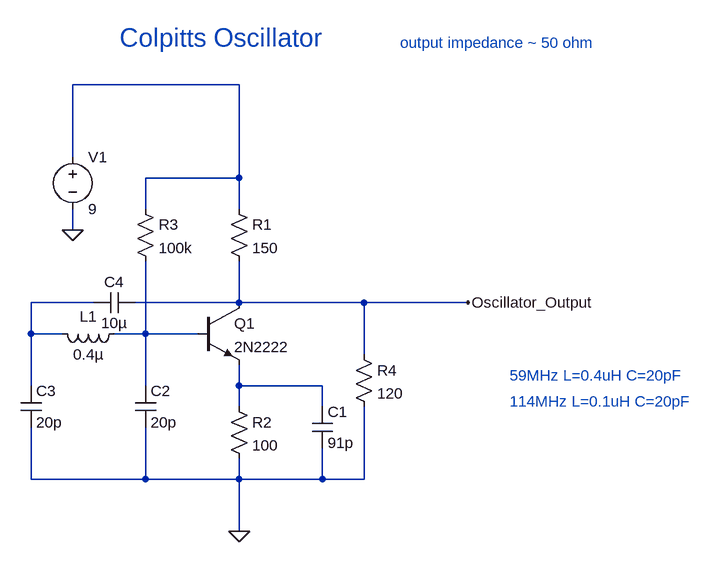
[diagram p0: schematic colpitts_oscillator.asc]
colpitts_oscillator.asc, the LTspice schematic file:
Version 4
SHEET 1 1004 736
WIRE 304 32 48 32
WIRE 48 144 48 32
WIRE 304 176 304 32
WIRE 304 176 160 176
WIRE 160 224 160 176
WIRE 304 224 304 176
WIRE 48 256 48 224
WIRE 80 368 -16 368
WIRE 304 368 304 304
WIRE 304 368 144 368
WIRE 496 368 304 368
WIRE 656 368 496 368
WIRE -16 416 -16 368
WIRE 32 416 -16 416
WIRE 160 416 160 304
WIRE 160 416 112 416
WIRE 240 416 160 416
WIRE 496 448 496 368
WIRE -16 496 -16 416
WIRE 160 496 160 416
WIRE 304 496 304 464
WIRE 432 496 304 496
WIRE 304 528 304 496
WIRE 432 528 432 496
WIRE -16 640 -16 560
WIRE 160 640 160 560
WIRE 160 640 -16 640
WIRE 304 640 304 608
WIRE 304 640 160 640
WIRE 432 640 432 592
WIRE 432 640 304 640
WIRE 496 640 496 528
WIRE 496 640 432 640
WIRE 304 720 304 640
FLAG 304 720 0
FLAG 656 368 Oscillator_Output
FLAG 48 256 0
DATAFLAG 304 352 "$"
DATAFLAG 208 416 "$"
DATAFLAG 304 496 "$"
SYMBOL npn 240 368 R0
SYMATTR InstName Q1
SYMATTR Value 2N2222
SYMBOL res 288 208 R0
SYMATTR InstName R1
SYMATTR Value 150
SYMBOL res 288 512 R0
SYMATTR InstName R2
SYMATTR Value 100
SYMBOL res 144 208 R0
SYMATTR InstName R3
SYMATTR Value 100k
SYMBOL cap 416 528 R0
SYMATTR InstName C1
SYMATTR Value 91p
SYMBOL ind 128 400 R90
WINDOW 0 5 56 VBottom 2
WINDOW 3 32 56 VTop 2
SYMATTR InstName L1
SYMATTR Value 0.4µ
SYMBOL cap 144 496 R0
SYMATTR InstName C2
SYMATTR Value 20p
SYMBOL cap -32 496 R0
SYMATTR InstName C3
SYMATTR Value 20p
SYMBOL cap 144 352 R90
WINDOW 0 0 32 VBottom 2
WINDOW 3 32 32 VTop 2
SYMATTR InstName C4
SYMATTR Value 10µ
SYMBOL voltage 48 128 R0
WINDOW 123 0 0 Left 0
WINDOW 39 0 0 Left 0
SYMATTR InstName V1
SYMATTR Value 9
SYMBOL res 480 432 R0
SYMATTR InstName R4
SYMATTR Value 120
TEXT 720 480 Left 2 ;59MHz L=0.4uH C=20pF
TEXT 720 520 Left 2 ;114MHz L=0.1uH C=20pF
TEXT 120 -40 Left 4 ;Colpitts Oscillator
TEXT 552 -32 Left 2 ;output impedance ~ 50 ohm

The netlist it stands for:
* colpitts_oscillator.asc
Q1 Oscillator_Output N003 N004 0 2N2222
R1 N001 Oscillator_Output 150
R2 N004 0 100
R3 N001 N003 100k
C1 N004 0 91p
L1 N003 N002 0.4µ
C2 N003 0 20p
C3 N002 0 20p
C4 Oscillator_Output N002 10µ
V1 N001 0 9
R4 Oscillator_Output 0 120
.model NPN NPN
.model PNP PNP
.lib standard.bjt
* 59MHz L=0.4uH C=20pF
* 114MHz L=0.1uH C=20pF
* Colpitts Oscillator
* output impedance ~ 50 ohm
.backanno
.end